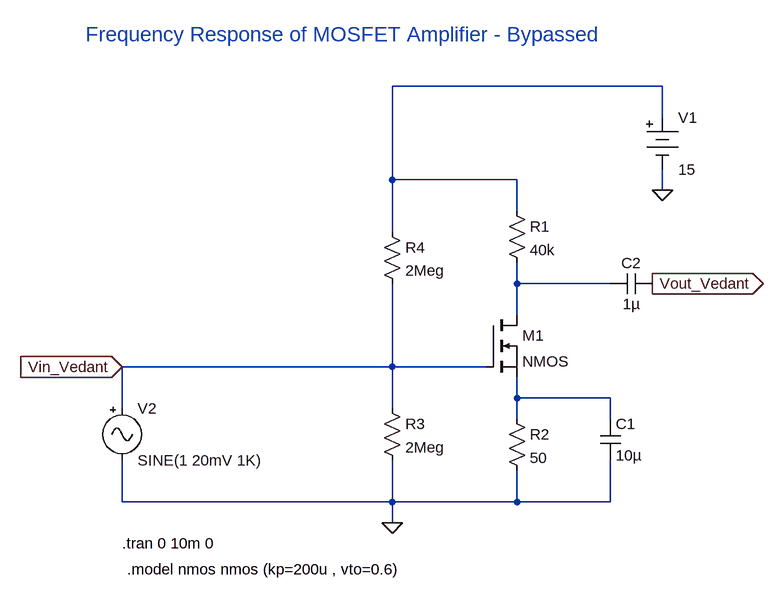
[diagram p0: schematic ECAD_exp3imp.asc]
ECAD_exp3imp.asc, the LTspice schematic file:
Version 4
SHEET 1 880 680
WIRE 464 -176 48 -176
WIRE 464 -128 464 -176
WIRE 48 -32 48 -176
WIRE 240 -32 48 -32
WIRE 464 -16 464 -48
WIRE 240 16 240 -32
WIRE 48 48 48 -32
WIRE 240 128 240 96
WIRE 384 128 240 128
WIRE 240 176 240 128
WIRE 48 256 48 128
WIRE 48 256 -368 256
WIRE 192 256 48 256
WIRE 240 304 240 272
WIRE 384 304 240 304
WIRE -368 320 -368 256
WIRE 48 320 48 256
WIRE 240 336 240 304
WIRE 384 336 384 304
WIRE -368 464 -368 400
WIRE 48 464 48 400
WIRE 48 464 -368 464
WIRE 240 464 240 416
WIRE 240 464 48 464
WIRE 384 464 384 400
WIRE 384 464 240 464
WIRE 48 496 48 464
FLAG 464 -16 0
FLAG 48 496 0
FLAG 448 128 Vout_Vedant
IOPIN 448 128 Out
FLAG -368 256 Vin_Vedant
IOPIN -368 256 In
SYMBOL nmos 192 176 R0
SYMATTR InstName M1
SYMBOL res 224 0 R0
SYMATTR InstName R1
SYMATTR Value 40k
SYMBOL res 224 320 R0
SYMATTR InstName R2
SYMATTR Value 50
SYMBOL res 32 304 R0
SYMATTR InstName R3
SYMATTR Value 2Meg
SYMBOL res 32 32 R0
SYMATTR InstName R4
SYMATTR Value 2Meg
SYMBOL Misc\\signal -368 304 R0
WINDOW 123 0 0 Left 0
WINDOW 39 0 0 Left 0
SYMATTR InstName V2
SYMATTR Value SINE(1 20mV 1K)
SYMBOL Misc\\battery 464 -144 R0
WINDOW 123 0 0 Left 0
WINDOW 39 0 0 Left 0
SYMATTR InstName V1
SYMATTR Value 15
SYMBOL cap 368 336 R0
SYMATTR InstName C1
SYMATTR Value 10µ
SYMBOL cap 448 112 R90
WINDOW 0 0 32 VBottom 2
WINDOW 3 32 32 VTop 2
SYMATTR InstName C2
SYMATTR Value 1µ
TEXT -360 568 Left 2 !.model nmos nmos (kp=200u , vto=0.6)
TEXT -368 528 Left 2 !.tran 0 10m 0
TEXT -424 -256 Left 3 ;Frequency Response of MOSFET Amplifier - Bypassed

The netlist it stands for:
* ECAD_exp3imp.asc
M1 N002 Vin_Vedant N003 N003 NMOS
R1 N001 N002 40k
R2 N003 0 50
R3 Vin_Vedant 0 2Meg
R4 N001 Vin_Vedant 2Meg
V2 Vin_Vedant 0 SINE(1 20mV 1K)
V1 N001 0 15
C1 N003 0 10µ
C2 Vout_Vedant N002 1µ
.model NMOS NMOS
.model PMOS PMOS
.lib standard.mos
.model nmos nmos (kp=200u , vto=0.6)
.tran 0 10m 0
* Frequency Response of MOSFET Amplifier - Bypassed
.backanno
.end